# EAGLE design Command Board Rev 2.4 (EAGLE 7.4.0)
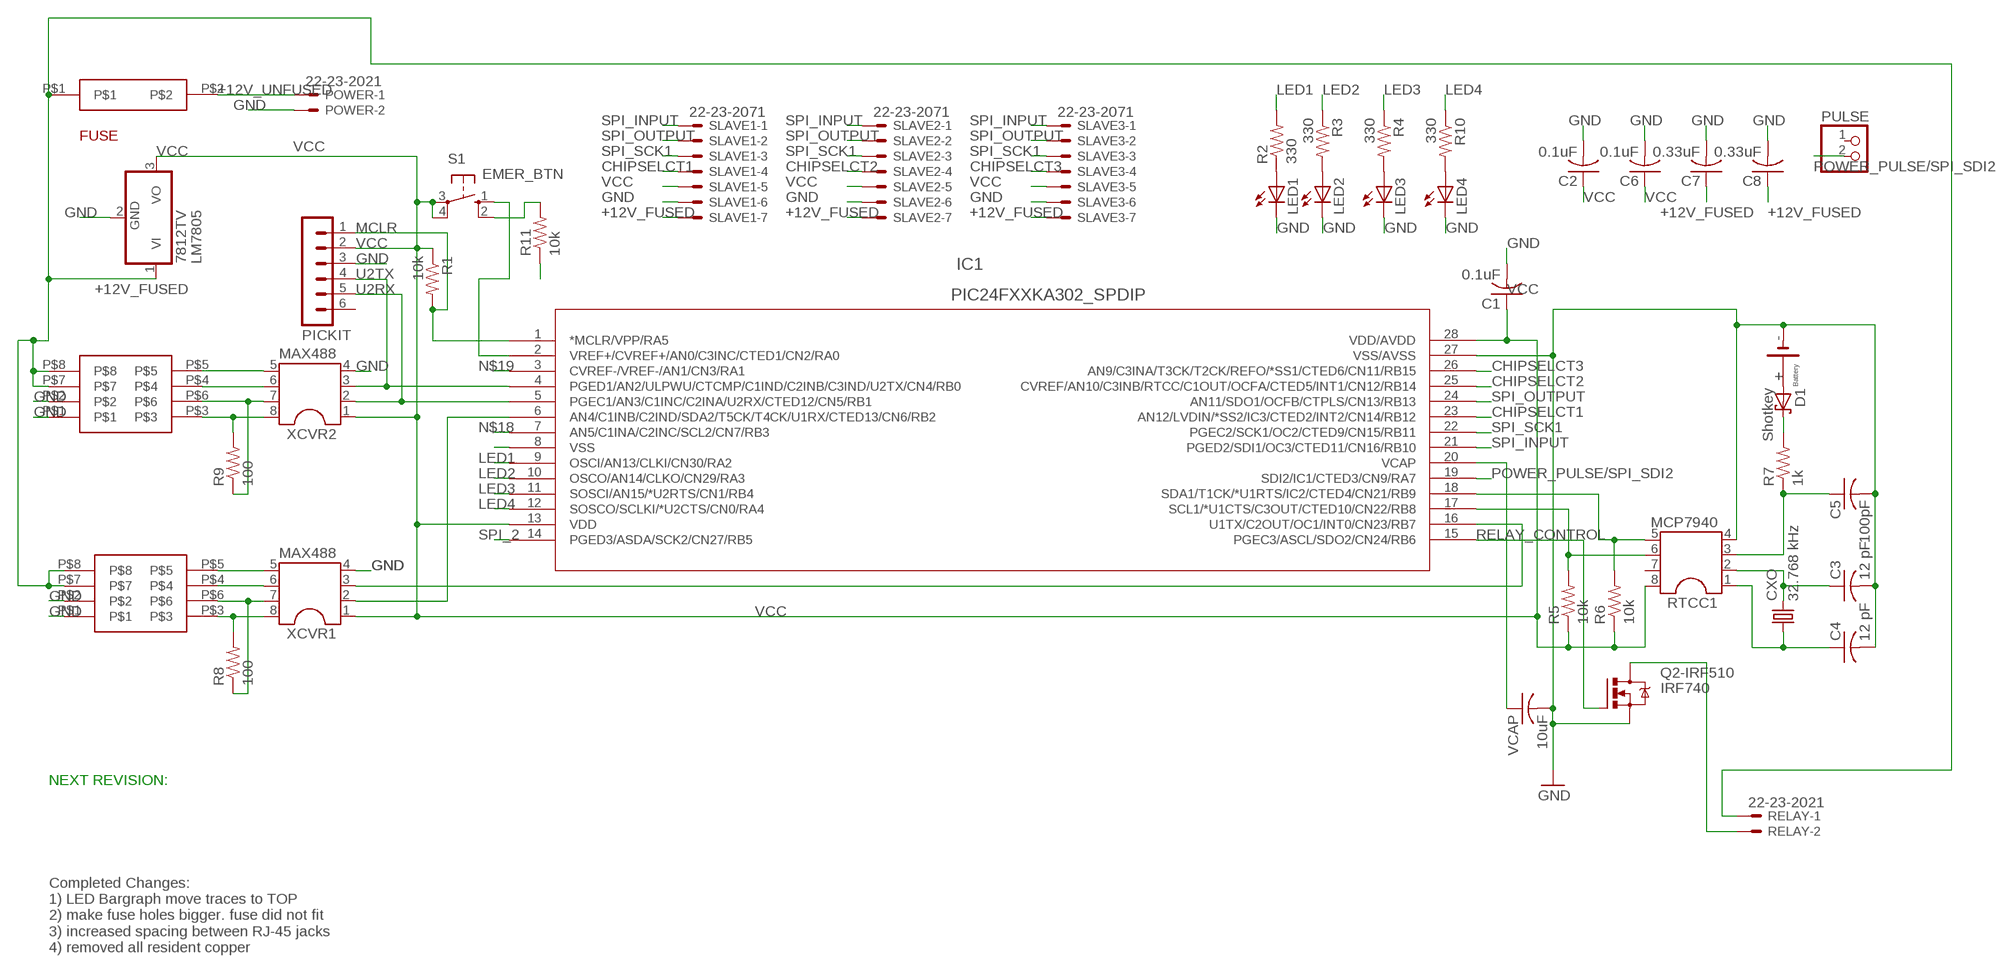
[diagram p0: schematic, sheet 1]

## Parts
BATTERY  BATT_S8211R  [BATT_S8211R]
C1  0.1uF  C-US025-025X050  [C025-025X050]
C2  0.1uF  C-US025-025X050  [C025-025X050]
C3  12 pF  C-US025-030X050  [C025-030X050]
C4  12 pF  C-US025-030X050  [C025-030X050]
C5  100pF  C-US075-042X103  [C075-042X103]
C6  0.1uF  C-US025-025X050  [C025-025X050]
C7  0.33uF  C-US025-025X050  [C025-025X050]
C8  0.33uF  C-US025-025X050  [C025-025X050]
CXO  32.768 kHz  CRYSTALTC26V  [TC26V]
D1  Shotkey  1N5817-B  [DO41-7.6]
F1  646_5X20  [646_5X20]
IC1  PIC24FXXKA302_SPDIP  [SPDIP28_300MC]
LED1  LED5MM  [LED5MM]
LED2  LED5MM  [LED5MM]
LED3  LED5MM  [LED5MM]
LED4  LED5MM  [LED5MM]
LM7805  7812TV  [TO220V]
PICKIT  MA06-1  [MA06-1]
POWER  22-23-2021  [22-23-2021]
PULSE  PINHD-1X2  [1X02]
Q2-IRF510  IRF740  [TO220BV]
R1  10k  R-US_0207/10  [0207/10]
R2  330  R-US_0207/10  [0207/10]
R3  330  R-US_0207/10  [0207/10]
R4  330  R-US_0207/10  [0207/10]
R5  10k  R-US_0207/10  [0207/10]
R6  10k  R-US_0207/10  [0207/10]
R7  1k  R-US_0207/10  [0207/10]
R8  100  R-US_0309/12  [0309/12]
R9  100  R-US_0309/12  [0309/12]
R10  330  R-US_0207/10  [0207/10]
R11  10k  R-US_0207/10  [0207/10]
RELAY  22-23-2021  [22-23-2021]
RJ1  CAT5  [CAT5]
RJ2  CAT5  [CAT5]
RTCC1  MCP7940  DIL8  [DIL08]
S1  EMER_BTN  40-XX  [B3F-40XX]
SLAVE1  22-23-2071  [22-23-2071]
SLAVE2  22-23-2071  [22-23-2071]
SLAVE3  22-23-2071  [22-23-2071]
VCAP  10uF  C-US025-050X050  [C025-050X050]
XCVR1  MAX488  DIL8  [DIL08]
XCVR2  MAX488  DIL8  [DIL08]

## Nets
+12V_FUSED: C7.1 C8.1 F1.P$1 LM7805.1(VI) RELAY.1 RJ1.P$7 RJ1.P$8 RJ2.P$7 RJ2.P$8 SLAVE1.7 SLAVE2.7 SLAVE3.7
+12V_UNFUSED: F1.P$2 POWER.1
CHIPSELCT1: IC1.23(AN12/LVDIN/*SS2/IC3/CTED2/INT2/CN14/RB12) SLAVE1.4
CHIPSELCT2: IC1.25(CVREF/AN10/C3INB/RTCC/C1OUT/OCFA/CTED5/INT1/CN12/RB14) SLAVE2.4
CHIPSELCT3: IC1.26(AN9/C3INA/T3CK/T2CK/REFO/*SS1/CTED6/CN11/RB15) SLAVE3.4
EMER_BTN_IN: IC1.2(VREF+/CVREF+/AN0/C3INC/CTED1/CN2/RA0) S1.1(S)
GND: BATTERY.P-(-) C1.2 C2.2 C3.2 C4.2 C5.2 C6.2 C7.2 C8.2 IC1.8(VSS) IC1.27(VSS/AVSS) LED1.K(C) LED2.K(C) LED3.K(C) LED4.K(C) LM7805.2(GND) PICKIT.3 POWER.2 Q2-IRF510.S R11.1 RJ1.P$1 RJ1.P$2 RJ2.P$1 RJ2.P$2 RTCC1.4 SLAVE1.6 SLAVE2.6 SLAVE3.6 VCAP.2 XCVR1.4 XCVR2.4
I2C_SCL1: IC1.17(SCL1/*U1CTS/C3OUT/CTED10/CN22/RB8) R5.2 RTCC1.6
I2C_SDA1: IC1.18(SDA1/T1CK/*U1RTS/IC2/CTED4/CN21/RB9) R6.2 RTCC1.5
LED1: IC1.9(OSCI/AN13/CLKI/CN30/RA2) R2.2
LED2: IC1.10(OSCO/AN14/CLKO/CN29/RA3) R3.1
LED3: IC1.11(SOSCI/AN15/*U2RTS/CN1/RB4) R4.1
LED4: IC1.12(SOSCO/SCLKI/*U2CTS/CN0/RA4) R10.1
MCLR: IC1.1(*MCLR/VPP/RA5) PICKIT.1 R1.2
N$1: BATTERY.P1+(+) BATTERY.P2+(+) D1.A
N$2: R11.2 S1.2(S1)
N$3: D1.C R7.2
N$11: LED1.A R2.1
N$18: IC1.7(AN5/C1INA/C2INC/SCL2/CN7/RB3)
N$19: IC1.3(CVREF-/VREF-/AN1/CN3/RA1)
N$22: LED4.A R10.2
N$23: LED2.A R3.2
N$25: LED3.A R4.2
POWER_PULSE/SPI_SDI2: IC1.19(SDI2/IC1/CTED3/CN9/RA7) PULSE.2
RELAY_CONTROL: IC1.15(PGEC3/ASCL/SDO2/CN24/RB6) Q2-IRF510.G
RELAY_SWITCHED: Q2-IRF510.D RELAY.2
RTCC_X1: C4.1 CXO.1 RTCC1.1
RTCC_X2: C3.1 CXO.2 RTCC1.2
SPI_2: IC1.14(PGED3/ASDA/SCK2/CN27/RB5)
SPI_INPUT: IC1.21(PGED2/SDI1/OC3/CTED11/CN16/RB10) SLAVE1.1 SLAVE2.1 SLAVE3.1
SPI_OUTPUT: IC1.24(AN11/SDO1/OCFB/CTPLS/CN13/RB13) SLAVE1.2 SLAVE2.2 SLAVE3.2
SPI_SCK1: IC1.22(PGEC2/SCK1/OC2/CTED9/CN15/RB11) SLAVE1.3 SLAVE2.3 SLAVE3.3
U1_A: R8.2 RJ2.P$3 XCVR1.8
U1_B: R8.1 RJ2.P$6 XCVR1.7
U1_Y: RJ2.P$5 XCVR1.5
U1_Z: RJ2.P$4 XCVR1.6
U1RX: IC1.6(AN4/C1INB/C2IND/SDA2/T5CK/T4CK/U1RX/CTED13/CN6/RB2) XCVR1.2
U1TX: IC1.16(U1TX/C2OUT/OC1/INT0/CN23/RB7) XCVR1.3
U2_A: R9.2 RJ1.P$3 XCVR2.8
U2_B: R9.1 RJ1.P$6 XCVR2.7
U2_Y: RJ1.P$5 XCVR2.5
U2_Z: RJ1.P$4 XCVR2.6
U2RX: IC1.5(PGEC1/AN3/C1INC/C2INA/U2RX/CTED12/CN5/RB1) PICKIT.5 XCVR2.2
U2TX: IC1.4(PGED1/AN2/ULPWU/CTCMP/C1IND/C2INB/C3IND/U2TX/CN4/RB0) PICKIT.4 XCVR2.3
VBAT_IN: C5.1 R7.1 RTCC1.3
VCAP: IC1.20(VCAP) VCAP.1
VCC: C1.1 C2.1 C6.1 IC1.13(VDD) IC1.28(VDD/AVDD) LM7805.3(VO) PICKIT.2 R1.1 R5.1 R6.1 RTCC1.8 S1.3(P) S1.4(P1) SLAVE1.5 SLAVE2.5 SLAVE3.5 XCVR1.1 XCVR2.1
Unconnected: PICKIT.6 PULSE.1 RTCC1.7

## Notes on the sheet
- NEXT REVISION:
- Completed Changes:
  1) LED Bargraph move traces to TOP
  2) make fuse holes bigger. fuse did not fit
  3) increased spacing between RJ-45 jacks
  4) removed all resident copper

## Library data of the parts
BATTERY = KWHr Library:BATT_S8211R
C1 C2 C6-C8 = adafruit:C-US: CAPACITOR, American symbol
C3 C4 VCAP = resistor:C-US: CAPACITOR, American symbol
C5 = rcl:C-US: CAPACITOR, American symbol
CXO = crystal:CRYSTAL: CRYSTAL; OC_FARNELL: unknown; OC_NEWARK: unknown
D1 = diode:1N581*: 1.0A SCHOTTKY BARRIER RECTIFIER Source: http://www.diodes.com/datasheets/ds23001.pdf
F1 = .KWHR Library:646_5X20
IC1 = KWHr Library:PIC24FXXKA302_SPDIP
LED1-LED4 = led:LED: LED OSRAM: - CHIPLED LG R971, LG N971, LY N971, LG Q971, LY Q971, LO R971, LY R971 LH N974, LH R974 LS Q976, LO Q976, LY Q976 LO Q996 - Hyper CHIPLED LW Q18S LB Q993, LB Q99A, LB R99A - SideLED LS A670, LO A670, LY A670, LG A670, LP A670 LB A673, LV A673, LT A673, LW A673 LH A674 LY A675 LS A676, LA A676, LO A676, LY A676, LW A676 LS A679, LY A679, LG A679 - Hyper Micro SIDELED® LS Y876, LA Y876, LO Y876, LY Y876 LT Y87S - SmartLED LW L88C, LW L88S LB L89C, LB L89S, LG L890 LS L89K, LO L89K, LY L89K LS L896, LA L896, LO L896, LY L896 - TOPLED LS T670, LO T670, LY T670, LG T670, LP T670 LSG T670, LSP T670, LSY T670, LOP T670, LYG T670 LG T671, LOG T671, LSG T671 LB T673, LV T673, LT T673, LW T673 LH T674 LS T676, LA T676, LO T676, LY T676, LB T676, LH T676, LSB T676, LW T676 LB T67C, LV T67C, LT T67C, LS T67K, LO T67K, LY T67K, LW E67C LS E67B, LA E67B, LO E67B, LY E67B, LB E67C, LV E67C, LT E67C LW T67C LS T679, LY T679, LG T679 LS T770, LO T770, LY T770, LG T770, LP T770 LB T773, LV T773, LT T773, LW T773 LH T774 LS E675, LA E675, LY E675, LS T675 LS T776, LA T776, LO T776, LY T776, LB T776 LHGB T686 LT T68C, LB T68C - Hyper Mini TOPLED® LB M676 - Mini TOPLED Santana® LG M470 LS M47K, LO M47K, LY M47K Source: http://www.osram.convergy.de LUXEON: - LUMILED® LXK2-PW12-R00, LXK2-PW12-S00, LXK2-PW14-U00, LXK2-PW14-V00 LXK2-PM12-R00, LXK2-PM12-S00, LXK2-PM14-U00 LXK2-PE12-Q00, LXK2-PE12-R00, LXK2-PE12-S00, LXK2-PE14-T00, LXK2-PE14-U00 LXK2-PB12-K00, LXK2-PB12-L00, LXK2-PB12-M00, LXK2-PB14-N00, LXK2-PB14-P00, LXK2-PB14-Q00 LXK2-PR12-L00, LXK2-PR12-M00, LXK2-PR14-Q00, LXK2-PR14-R00 LXK2-PD12-Q00, LXK2-PD12-R00, LXK2-PD12-S00 LXK2-PH12-R00, LXK2-PH12-S00 LXK2-PL12-P00, LXK2-PL12-Q00, LXK2-PL12-R00 Source: www.luxeon.com KINGBRIGHT: KA-3528ASYC Source: www.kingbright.com
LM7805 = linear:78*: Positive VOLTAGE REGULATOR Source: http://cache.national.com/ds/LM/LM78L05.pdf http://www.fairchildsemi.com/ds/LM/LM7805.pdf
PICKIT = con-lstb:MA06-1: PIN HEADER; OC_FARNELL: unknown; OC_NEWARK: unknown
POWER RELAY = con-molex:22-23-2021: .100" (2.54mm) Center Header - 2 Pin; MF: MOLEX; MPN: 22-23-2021; OC_FARNELL: 1462926; OC_NEWARK: 25C3832
PULSE = pinhead:PINHD-1X2: PIN HEADER
Q2-IRF510 = transistor-power:IRF740: N-CHANNEL MOS FET
R1-R7 R10 R11 = resistor:R-US_: RESISTOR, American symbol
R8 R9 = adafruit:R-US_: RESISTOR, American symbol
RJ1 RJ2 = .KWHR Library:CAT5
RTCC1 XCVR1 XCVR2 = ic-package:DIL8: Dual In Line / Socket
S1 = switch-omron:40-XX: OMRON SWITCH; MF: OMRON COMPONENTS USA; MPN: B3F-4000; OC_FARNELL: 176434; OC_NEWARK: 36K3105
SLAVE1-SLAVE3 = con-molex:22-23-2071: .100" (2.54mm) Center Header - 7 Pin; MF: MOLEX; MPN: 22-23-2071; OC_FARNELL: 1654534; OC_NEWARK: 56H0445

## Net classes
0 default: width 0.61 mm
1 24mil: width 0.61 mm

## Board
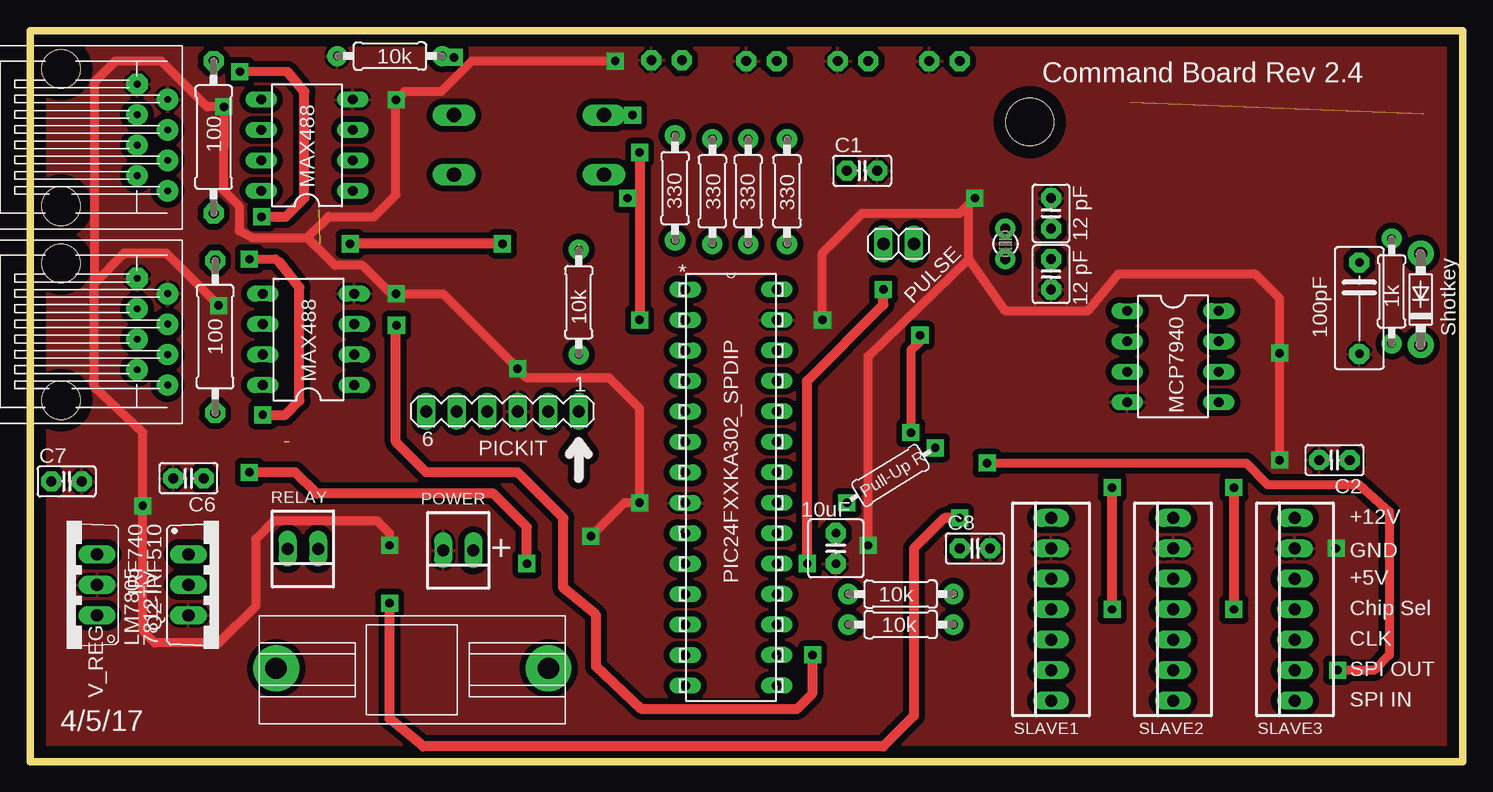
[diagram p1: board, top side]
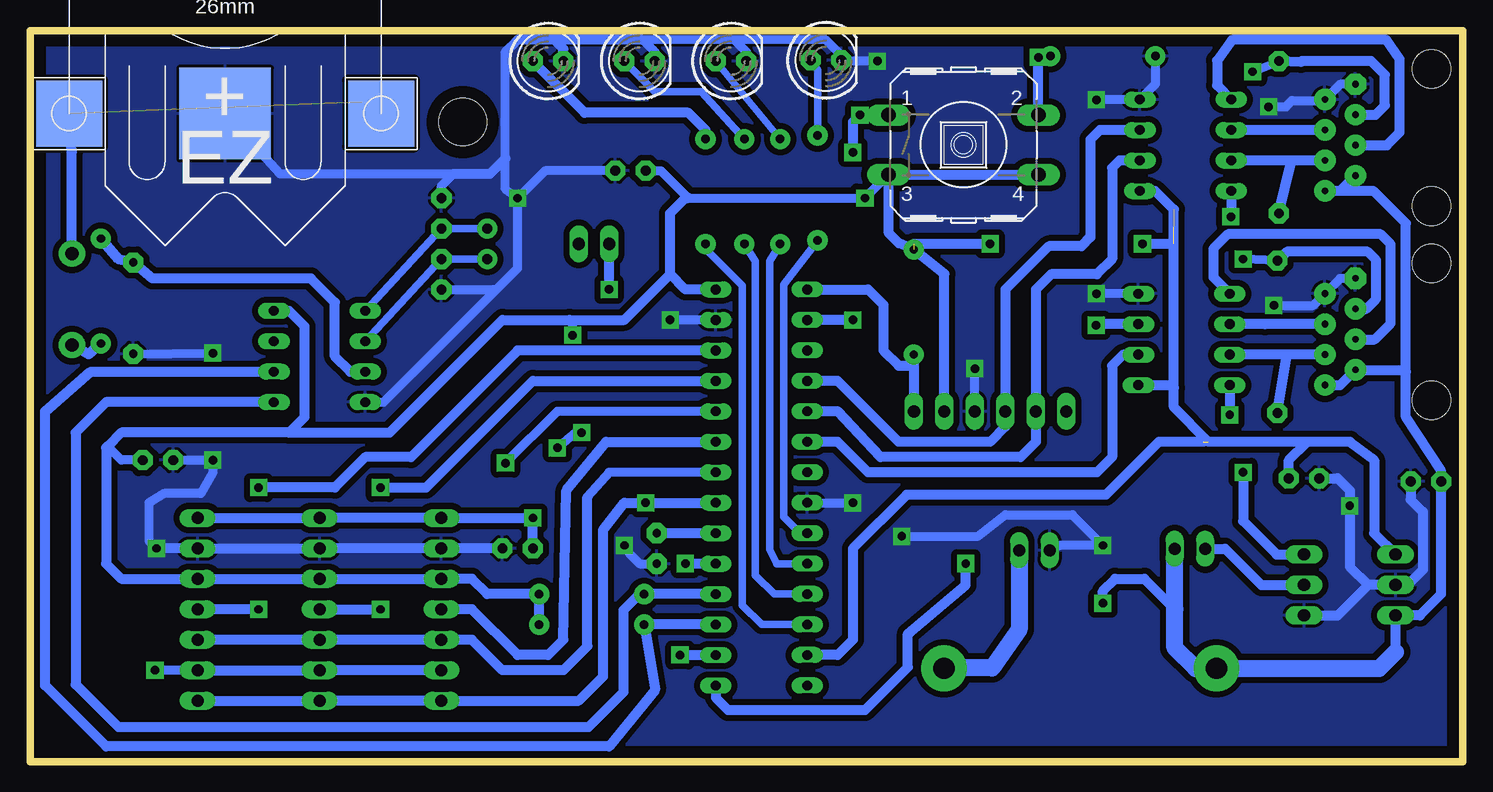
[diagram p2: board, bottom side, seen from below]

Size 119.38 x 60.96 mm. Coordinates in mm from the lower left corner, seen from the top.
Outline: 0,0 119.38,0 119.38,60.96 0,60.96 0,0
Copper layers (1*16): Inward_Top 0.035mm / dielectric 1.5mm / Outward_Bottom 0.035mm
Design rules "default *": minimum track width 10mil, minimum drill 22mil, track to track 20mil, track to pad 20mil, pad to pad 20mil, via to via 20mil, smd to smd 8mil, copper to edge 40mil, drill to drill 8mil, minimum pad ring 10mil, minimum via ring 8mil, stop-mask expansion 4mil, vias tented up to drill 0mil, thermal gap 10mil
Holes 3.97 mm at 83.31,53.34

### Footprints (pad centres in the part's own frame; a part is rotated, then mirrored left to right if it is on the bottom)
BATT_S8211R = smd 5.5 x 5.5: P1+ -13,0; P2+ 13,0 | smd 7.62 x 7.62: P- 0,0
C025-025X050 = drill 0.813 pad 1.676 octagon: 1 -1.27,0; 2 1.27,0
C025-030X050 = drill 0.813 pad 1.676 octagon: 1 -1.27,0; 2 1.27,0
C075-042X103 = drill 0.7 pad 1.676 octagon: 1 -3.81,0; 2 3.81,0
TC26V = drill 0.813 pad 1.676: 1 -1.27,0; 2 1.27,0
DO41-7.6 = drill 1.1 pad 2.184: A 3.81,0; C -3.81,0
646_5X20 = drill 1.778 pad 3.81: P$1 1.4,4.6; P$2 24.1,4.6
SPDIP28_300MC = drill 0.813 long: 1 -7.62,33.02; 2 -7.62,30.48; 3 -7.62,27.94; 4 -7.62,25.4; 5 -7.62,22.86; 6 -7.62,20.32; 7 -7.62,17.78; 8 -7.62,15.24; 9 -7.62,12.7; 10 -7.62,10.16; 11 -7.62,7.62; 12 -7.62,5.08; 13 -7.62,2.54; 14 -7.62,0; 15 0,0; 16 0,2.54; 17 0,5.08; 18 0,7.62; 19 0,10.16; 20 0,12.7; 21 0,15.24; 22 0,17.78; 23 0,20.32; 24 0,22.86; 25 0,25.4; 26 0,27.94; 27 0,30.48; 28 0,33.02
LED5MM = drill 0.813 pad 1.676 octagon: A -1.27,0; K 1.27,0
TO220V = drill 1.016 long: 1 -2.54,-2.54; 2 0,-2.54; 3 2.54,-2.54
MA06-1 = drill 1.016 long: 1 -6.35,0; 2 -3.81,0; 3 -1.27,0; 4 1.27,0; 5 3.81,0; 6 6.35,0
22-23-2021 = drill 1 long: 1 -1.27,0; 2 1.27,0
1X02 = drill 1.016 long: 1 -1.27,0; 2 1.27,0
TO220BV = drill 1.016 long: D 0,-2.54; G -2.54,-2.54; S 2.54,-2.54
0207/10 = drill 0.7 pad 1.676: 1 -4.559,0; 2 4.191,0
0309/12 = drill 0.813 pad 1.676 octagon: 1 -6.35,0; 2 6.35,0
CAT5 = drill 0.56 pad 1.778 octagon: P$1 9.495,3.77 | drill 0.56 pad 1.778: P$2 8.225,1.23; P$3 6.955,3.77; P$4 5.685,1.23; P$5 4.415,3.77; P$6 3.145,1.23; P$7 1.875,3.77; P$8 0.605,1.23 | hole 3.2: -0.665,10.12; 10.765,10.12
DIL08 = drill 0.813 long: 1 -3.81,-3.81; 2 -1.27,-3.81; 3 1.27,-3.81; 4 3.81,-3.81; 5 3.81,3.81; 6 1.27,3.81; 7 -1.27,3.81; 8 -3.81,3.81
B3F-40XX = drill 1.194 long: 1 -6.248,2.489; 2 6.248,2.489; 3 -6.248,-2.489; 4 6.248,-2.489
22-23-2071 = drill 1 long: 1 -7.62,0; 2 -5.08,0; 3 -2.54,0; 4 0,0; 5 2.54,0; 6 5.08,0; 7 7.62,0
C025-050X050 = drill 0.7 pad 1.676 octagon: 1 -1.27,0; 2 1.27,0

### Placement (x,y rotation side)
BATTERY  103.12,54.04 180 bottom
C1  69.34,49.28 0 top
C2  108.71,25.15 180 top
C3  85.09,40.64 270 top
C4  85.09,45.72 90 top
C5  110.78,37.81 270 top
C6  13.21,23.62 180 top
C7  3.05,23.37 0 top
C8  78.74,17.78 0 top
CXO  81.28,43.18 270 top
D1  115.89,38.54 90 top
F1  19.11,3.17 0 top
IC1  62.23,6.35 0 top
LED1  53.05,58.48 0 bottom
LED2  60.96,58.42 0 bottom
LED3  68.58,58.42 0 bottom
LED4  76.2,58.42 0 bottom
LM7805  3.05,14.73 90 top
PICKIT  39.37,29.21 180 top
POWER  35.69,17.62 180 top
PULSE  72.39,43.18 180 top
Q2-IRF510  15.75,14.73 270 top
R1  45.73,38.14 270 top
R2  53.75,47.66 270 top
R3  56.86,47.72 90 top
R4  59.85,47.72 90 top
R5  72.39,11.43 180 top
R6  72.39,13.97 180 top
R7  113.47,39.05 270 top
R8  15.43,35.43 90 top
R9  15.3,52.07 90 top
R10  63.09,47.72 90 top
R11  30.16,58.83 0 top
RELAY  22.73,17.75 180 top
RJ1  12.7,46.99 90 top
RJ2  12.7,30.8 90 top
RTCC1  95.25,33.78 270 top
S1  41.59,51.44 0 bottom
SLAVE1  85.09,12.7 90 top
SLAVE2  95.25,12.7 90 top
SLAVE3  105.41,12.7 90 top
U$4  [RES_FOOTPRINT]  71.69,23.84 31.4 top
VCAP  67.15,17.78 270 top
XCVR1  23.21,35.21 90 top
XCVR2  23.08,51.4 90 top

### Tracks (layer width: path | path; a pad name or v marks a point on that pad's centre or on a via)
+12V_FUSED  (via drill 0.7 pad 1.42)
  Inward_Top 0.813: v77.47,20.32 76.2,20.32 73.66,17.78 73.66,3.81 71.12,1.27 32.77,1.27 29.97,3.56 v29.97,13.21
  Outward_Bottom 0.813: RJ2.P$8 10.2,31.4 RJ2.P$7 4.89,32.67 4.73,32.51 | RJ1.P$8 10.2,47.59 | 10.2,47.59 RJ1.P$7 | 4.73,32.51 4.73,28.73 1.78,24.23 C7.1 1.78,13.97 3.56,12.19 LM7805.1 5.59,9.14 | 4.73,32.51 4.73,44.9 7.46,47.59 10.2,47.59 | 23.97,17.72 RELAY.1 | SLAVE3.7 SLAVE2.7 SLAVE1.7 v77.47,20.32 C8.1 | v29.97,13.21 29.97,14.22 28.96,15.24 26.51,15.24 23.97,12.7
  Outward_Bottom 1.422: 23.97,17.72 23.97,12.7 23.97,9.49 22.25,7.78 F1.P$1 6.96,7.78 5.59,9.14
+12V_UNFUSED
  Outward_Bottom 1.422: POWER.1 36.96,11.02 39.21,7.81 43.24,7.8 F1.P$2
CHIPSELCT1
  Outward_Bottom 0.813: IC1.23 71.37,26.67 74.68,22.61 74.93,10.16 76.2,8.89 78.74,8.89 82.55,12.7 SLAVE1.4
CHIPSELCT2  (via drill 0.7 pad 1.42)
  Inward_Top 0.813: v90.17,12.7 v90.17,22.86
  Outward_Bottom 0.813: SLAVE2.4 v90.17,12.7 | v90.17,22.86 86.36,22.86 77.47,31.75 IC1.25
CHIPSELCT3  (via drill 0.7 pad 1.42)
  Inward_Top 0.813: v100.33,22.86 v100.33,12.7
  Outward_Bottom 0.813: IC1.26 78.74,34.29 87.63,25.4 91.44,25.4 93.98,22.86 v100.33,22.86 | v100.33,12.7 SLAVE3.4
EMER_BTN_IN  (via drill 0.7 pad 1.42)
  Inward_Top 0.813: v50.8,50.8 v50.8,36.83
  Outward_Bottom 0.813: S1.1 v50.22,53.92 50.8,53.34 v50.8,50.8 | v50.8,36.83 IC1.2
GND  (via drill 0.7 pad 1.42)
  Inward_Top 0.762: 5.33,39.88 5.33,31.24 9.4,27.43 v9.4,21.34 9.4,10.92 10.41,9.91 15.75,9.91 18.8,12.95 18.8,18.54 20.32,20.07 28.96,20.07 29.97,19.05 v29.97,18.03 | 5.33,39.88 7.87,42.42 11.34,42.42 v15.72,38.04 | 5.33,39.88 5.33,56.64 7.11,58.42 10.92,58.42 14.73,54.61 v16.16,54.61 16.1,47.66 17.43,46.32 17.43,44.29 18.54,43.69 23.11,43.69 | 23.11,43.69 24.89,45.47 28.7,45.47 30.48,47.24 30.48,55.15 v30.51,55.18 31.21,55.88 34.29,55.88 36.83,58.42 v48.77,58.42 | 23.11,43.69 25.4,41.4 27.69,41.4 30.07,39.02 v30.51,39.02 34.38,39.02 v40.64,32.77 41.4,32 48.26,32 50.8,29.46 v50.8,21.59 49.53,21.59 v46.74,18.8 | 78.23,41.91 81.28,37.59 88.14,37.59 90.68,40.64 102.11,40.64 104.14,38.61 v104.14,34.07 v104.14,25.15 | 78.23,41.91 78.23,46.48 v78.74,46.99 77.47,45.72 69.34,45.72 66.04,42.42 v66.04,36.83 | v69.85,18.03 69.85,33.78 78.23,41.91
  Outward_Bottom 0.762: v30.51,55.18 30.51,55.21 XCVR2.4 25.6,56.5 R11.1 | RJ1.P$1 10.2,56.48 RJ1.P$2 11.57,55.12 14.22,55.12 14.73,54.61 v16.16,54.61 | RJ2.P$1 10.2,40.29 RJ2.P$2 12.46,38.04 v15.72,38.04 | IC1.27 v66.04,36.83 | PICKIT.3 v40.64,32.77 | XCVR1.4 v30.51,39.02 | POWER.2 33.5,18.03 v29.97,18.03 32.51,20.57 38.1,20.57 40.39,18.8 v46.74,18.8 | C5.2 104.3,34.07 v104.14,34.07 | BATTERY.P- 103.06,54.04 98.55,49.02 84.07,49.02 85.09,48.01 C4.2 | v78.74,46.99 79.76,47.75 79.76,50.29 79.76,59.18 78.87,60.07 | RTCC1.4 89.92,29.97 80.64,39.24 | 80.64,39.24 78.74,41.15 v78.74,46.99 | C3.2 80.77,39.37 80.64,39.24 | v108.84,17.78 109.47,18.41 109.47,21.59 108.2,22.35 105.16,22.35 104.14,24.13 v104.14,25.15 C2.2 | IC1.8 v50.8,21.59 | v69.85,18.03 69.34,17.27 68.58,16.51 VCAP.2 | LED3.K 67.31,59.18 68.33,60.2 60.71,60.2 | LED2.K 59.69,59.18 60.71,60.2 | 60.71,60.2 53.09,60.2 51.78,58.9 LED1.K 51.72,58.42 v48.77,58.42 | C1.2 76.45,49.28 v78.74,46.99
  Outward_Bottom 0.813: v108.84,17.78 SLAVE3.6 SLAVE2.6 SLAVE1.6 C8.2 | 84.07,49.02 81.03,49.02 79.76,50.29 | 68.33,60.2 75.69,60.2 | 75.69,60.2 78.74,60.2 78.87,60.07 | LED4.K 74.93,59.44 75.69,60.2 | C6.2 10.41,23.62 9.4,22.61 v9.4,21.34 9.4,16.26 7.87,14.73 | Q2-IRF510.S 10.41,12.19 7.87,14.73 | 7.87,14.73 LM7805.2 4.57,14.73 3.3,16 3.3,20.83 4.32,21.84 C7.2
  pour Outward_Bottom: 0,60.96 119.48,60.99 119.41,-0.1 0,0
  pour Inward_Top: 0,60.96 119.48,60.96 119.28,-0.1 0,0
I2C_SCL1
  Outward_Bottom 0.813: IC1.17 R5.2 67.28,6 71.12,1.27 113.03,1.27 118.11,6.35 118.11,29.21 114.3,32.51 RTCC1.6
I2C_SDA1
  Outward_Bottom 0.813: IC1.18 R6.2 68.58,13.97 69.91,12.64 69.91,5.81 72.83,2.89 112.01,2.89 115.57,6.45 115.57,27.43 113.03,29.97 RTCC1.5
LED1
  Outward_Bottom 0.61: IC1.9 55.18,19.05 56.55,20.41 56.55,39.78 R2.2
LED2
  Outward_Bottom 0.61: IC1.10 57.15,16.51 57.75,17.68 57.75,41.75 R3.1
LED3
  Outward_Bottom 0.61: IC1.11 57.37,13.97 58.93,15.53 58.93,41.72 R4.1
LED4
  Outward_Bottom 0.61: R10.1 62.99,42.64 60.04,39.69 60.04,13.05 58.42,11.43 IC1.12
MCLR
  Outward_Bottom 0.813: PICKIT.1 45.73,29.22 R1.2 45.77,33.02 46.99,33.02 48.26,34.29 48.26,38.1 49.53,39.37 IC1.1
N$1  (1 unrouted)
  Outward_Bottom 0.61: 91.69,54.99 BATTERY.P1+
  Outward_Bottom 0.813: 117.41,55.29 BATTERY.P2+ 116.14,54.02 115.89,50.86 D1.A
N$2  (via drill 0.7 pad 1.42)
  Outward_Bottom 0.813: S1.2 v35.34,58.73 R11.2
N$3
  Outward_Bottom 0.813: D1.C 114.49,33.97 R7.2
N$10
  Inward_Top 0.813: 45.72,26.67 45.72,23.62 | 45.72,26.67 44.96,25.65 | 45.72,26.67 46.48,25.65
N$11
  Outward_Bottom 0.61: R2.1 53.75,57.66 LED1.A
N$22
  Outward_Bottom 0.813: R10.2 63.09,52.67 64.52,54.1 73.15,54.1 LED4.A
N$23
  Outward_Bottom 0.61: R3.2 LED2.A
N$25
  Outward_Bottom 0.61: LED3.A 67.31,55.88 63.44,55.88 R4.2
POWER_PULSE/SPI_SDI2  (via drill 0.7 pad 1.42)
  Inward_Top 0.813: v64.77,16.51 64.77,31.75 71.12,38.1 v71.12,39.37
  Outward_Bottom 0.813: IC1.19 v64.77,16.51 | v71.12,39.37 PULSE.2
RELAY_CONTROL  (via drill 0.7 pad 1.42)
  Inward_Top 0.813: v41.4,16.51 41.4,19.56 38.61,22.35 23.88,22.35 22.1,24.13 v18.29,24.13
  Outward_Bottom 0.813: IC1.15 62.23,5.33 61.21,4.32 49.78,4.32 46.23,7.87 46.23,10.67 41.4,14.73 v41.4,16.51 | v18.29,24.13 18.29,20.07 15.49,17.27 Q2-IRF510.G
RELAY_SWITCHED
  Outward_Bottom 0.813: RELAY.2 19.78,17.75 16.76,14.73 Q2-IRF510.D
RTCC_X1
  Outward_Bottom 0.61: CXO.1 C4.1 RTCC1.1
RTCC_X2
  Outward_Bottom 0.61: CXO.2 C3.1 RTCC1.2
SPI_INPUT  (via drill 0.7 pad 1.42)
  Outward_Bottom 0.813: SLAVE3.1 SLAVE2.1 SLAVE1.1 73.66,5.08 71.63,7.11 71.63,19.3 69.85,21.59 v68.07,21.59 IC1.21
SPI_OUTPUT  (via drill 0.7 pad 1.42)
  Inward_Top 0.762: v79.76,24.89 101.35,24.89 103.12,23.11 110.74,23.11 113.28,20.83 113.28,8.89 112.01,7.62 v108.97,7.62
  Outward_Bottom 0.762: IC1.24 75.44,29.21 v79.76,24.89 | SLAVE3.2 v108.97,7.62
  Outward_Bottom 0.813: SLAVE3.2 SLAVE2.2 SLAVE1.2
SPI_SCK1
  Outward_Bottom 0.762: IC1.22 71.12,24.13 72.93,22.07
  Outward_Bottom 0.813: SLAVE3.3 SLAVE2.3 SLAVE1.3 82.55,10.16 80.01,7.62 74.93,7.62 72.93,9.62 72.93,22.07
U1_A  (via drill 0.7 pad 1.42)
  Inward_Top 0.762: v18.29,41.91 20.47,41.91 21.09,41.3
  Inward_Top 0.813: v19.4,28.92 21.27,28.92 22.45,30.1 22.45,39.56 21.09,41.3 20.83,41.62
  Outward_Bottom 0.762: R8.2 v18.29,41.91
  Outward_Bottom 0.813: XCVR1.8 v19.4,28.92 | RJ2.P$3 8.03,37.75 7.21,38.58 7.21,41.81 7.91,42.51 14.64,42.51 R8.2
U1_B
  Outward_Bottom 0.813: RJ2.P$6 14.61,33.94 | 14.61,33.94 XCVR1.7 | 14.61,33.94 14.67,33.88 R8.1
U1_Y
  Outward_Bottom 0.813: RJ2.P$5 7.33,35.21 6,36.54 6,43.15 6.83,43.97 19.56,43.97 20.77,42.77 20.77,40.39 XCVR1.5
U1_Z
  Outward_Bottom 0.813: RJ2.P$4 16.45,36.48 XCVR1.6
U1RX
  Outward_Bottom 0.813: XCVR1.2 28.29,33.94 29.21,33.02 29.21,25.4 30.48,24.13 49.53,24.13 52.07,26.67 IC1.6
U1TX  (via drill 0.7 pad 1.42)
  Inward_Top 0.813: v65.22,8.89 65.22,5.71 63.88,4.38 50.99,4.38 47.18,7.94 47.18,12.22 44.45,14.48 44.45,20.32 40.64,24.13 33.02,24.13 30.48,26.67 30.48,36.32 v30.54,36.39
  Outward_Bottom 0.813: XCVR1.3 30.45,36.48 v30.54,36.39 | v65.22,8.89 IC1.16
U2_A  (via drill 0.7 pad 1.42)
  Inward_Top 0.762: 21.46,57.53 v17.49,57.53
  Inward_Top 0.813: v19.3,45.43 21.3,45.43 22.86,46.99 22.86,55.88 21.46,57.53
  Outward_Bottom 0.762: v17.49,57.53 R9.2
  Outward_Bottom 0.813: RJ1.P$3 7.24,53.95 6.48,54.7 6.48,57.28 7.62,58.42 13.37,58.42 13.46,58.33 R9.2 | XCVR2.8 19.27,45.47 v19.3,45.43
U2_B
  Outward_Bottom 0.813: RJ1.P$6 14.45,50.13 | 14.45,50.13 16.76,50.13 XCVR2.7 | R9.1 14.29,49.98 14.45,50.13
U2_Y
  Outward_Bottom 0.813: RJ1.P$5 6.32,51.41 5.24,52.48 5.24,58.58 6.35,60.2 19.21,60.2 20.45,58.45 20.45,56.39 XCVR2.5
U2_Z
  Outward_Bottom 0.813: RJ1.P$4 XCVR2.6
U2RX
  Outward_Bottom 0.813: XCVR2.2 28.61,50.13 29.21,49.53 29.21,41.91 30.48,40.64 34.29,40.64 35.56,39.37 PICKIT.5 35.56,26.67 36.83,25.4 48.51,25.4 52.07,29.21 IC1.5
U2TX
  Outward_Bottom 0.813: XCVR2.3 30.23,52.67 31.02,51.88 31.02,43.72 31.75,42.99 34.48,42.99 38.1,39.37 PICKIT.4 38.1,27.94 39.37,26.67 46.99,26.67 52.07,31.75 IC1.4
VBAT_IN
  Outward_Bottom 0.813: R7.1 111.98,41.88 C5.1 109.19,40.29 95.98,40.29 93.98,38.29 93.98,33.78 92.71,32.51 RTCC1.3
VCAP
  Outward_Bottom 0.813: IC1.20 VCAP.1
VCC  (via drill 0.7 pad 1.42)  (3 unrouted)
  Inward_Top 0.762: v74.17,35.56 74.17,35.05 73.41,34.29 v73.41,27.43
  Inward_Top 0.813: v39.37,43.18 v26.67,43.18
  Outward_Bottom 0.762: C1.1 66.8,49.28 64.52,46.99 v49.8,46.99 S1.3 | C2.1 111.76,25.15 112.9,26.29 | v74.17,35.56 74.17,36.58 74.42,36.83 | v73.41,27.43 73.91,27.43 v75.44,26.16
  Outward_Bottom 0.813: S1.4 S1.3 v47.82,48.92 47.82,44.07 46.97,43.22 R1.1 43.18,40.67 PICKIT.2 | 12.95,26.67 9.4,26.67 7.37,25.15 7.37,19.05 LM7805.3 | 12.95,26.67 21.18,26.67 24.07,29.56 24.07,31.18 | 24.07,31.18 24.07,46.04 25.62,47.59 XCVR2.1 | XCVR1.1 24.29,31.4 24.07,31.18 | 66.04,40.64 66.04,45.72 64.77,46.99 64.52,46.99 | R5.1 R6.1 81.28,13.97 82.55,15.24 SLAVE1.5 SLAVE2.5 SLAVE3.5 111.76,15.24 113.03,16.51 113.03,26.16 112.9,26.29 111.76,27.43 97.79,27.43 | IC1.28 64.77,39.37 66.04,40.64 | RTCC1.8 97.79,37.59 96.52,36.32 96.52,28.7 97.79,27.43 | 97.79,27.43 89.41,27.43 80.01,36.83 74.42,36.83 69.85,36.83 66.04,40.64 | 21.59,26.67 25.3,26.67 29.72,22.26 46.32,22.26 50.8,17.78 50.8,10.16 52.07,8.89 IC1.13 | 45.72,43.18 v39.37,43.18 | v26.67,43.18 24.13,43.18 | C6.1 14.48,25.15 12.95,26.67

### Text on the board
tPlace: Command Board Rev 2.4 | +12V | GND | +5V | Chip Sel | CLK | SPI OUT | V_REG | SPI IN | 4/5/17
tNames: +